# Altium schematic sheet UWB_5V-3V3_LDO.SchDoc
size A2; Organization: Altium Limited; Address1: L3, 12a Rodborough Rd; Address2: Frenchs Forest; Address3: NSW; Address4: Australia 2086
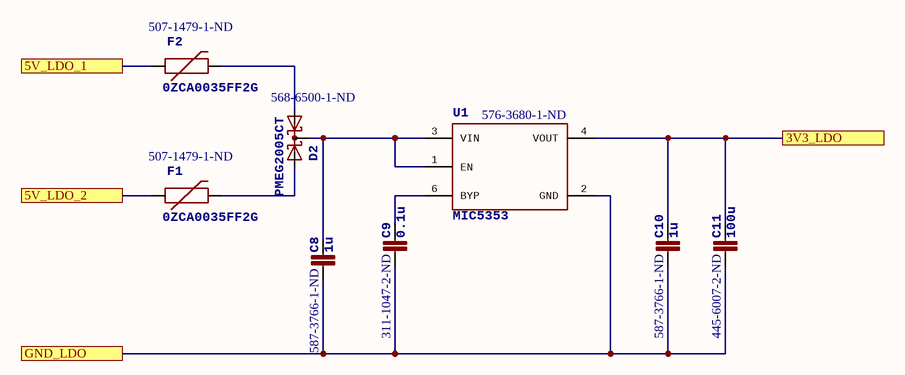
[diagram p0: UWB_5V-3V3_LDO.SchDoc]

## Parts
C8  1u  Supplier Part Number 1: 587-3766-1-ND  [0603-CAP]
C9  0.1u  Supplier Part Number 1: 311-1047-2-ND  [0402-CAP]
C10  1u  Supplier Part Number 1: 587-3766-1-ND  [0603-CAP]
C11  100u  Supplier Part Number 1: 445-6007-2-ND  [1206-CAP]
D2  PMEG2005CT  Supplier Part Number 1: 568-6500-1-ND  [SOT23-3]
F1  0ZCA0035FF2G  Supplier Part Number 1: 507-1479-1-ND  [PTC-1206]
F2  0ZCA0035FF2G  Supplier Part Number 1: 507-1479-1-ND  [PTC-1206]
U1  MIC5353  Supplier Part Number 1: 576-3680-1-ND  [MLF-6-1.6MM]

## Ports
3V3_LDO, 5V_LDO_1, 5V_LDO_2, GND_LDO

## Nets
3V3_LDO: C10.1 C11.1 U1.4(VOUT) ; port 3V3_LDO
5V_LDO_1: F2.1 ; port 5V_LDO_1
5V_LDO_2: F1.1 ; port 5V_LDO_2
GND_LDO: C8.2 C9.2 C10.2 C11.2 U1.2(GND) ; port GND_LDO
NetC8_1: C8.1 D2.3(CC) U1.1(EN) U1.3(VIN)
NetC9_1: C9.1 U1.6(BYP)
NetD2_1: D2.1(A1) F2.2
NetD2_2: D2.2(A2) F1.2

## Notes on the sheet
- https://github.com/OpenMotorDrive
- Title
- ProfiCNC Pty. Ltd.
- https://creativecommons.org/licenses/by-nc-sa/4.0/
- For Commercial use, please contact ProfiCNC
- ProfiCNC does NOT guaranty these drawings as fit for any purpose, you must verify this information before attempting to use it in any way.  USE AT OWN RISK
- Size:
- Date:
- File:
- A2
- Number:
- Time:
- Revision:
- Sheet
- of

## Library data of the parts
C8 C10 = CAPACITOR-0603: PARTNO: LMK107B7105KA-T; DOC_NUM: 1; YEAR: 2014; REV: X2; Supplier 1: Digi-Key
C9 = CAPACITOR-0402: PARTNO: LMK105BJ104KV-F; DOC_NUM: 1; YEAR: 2014; REV: X2; Supplier 1: Digi-Key
C11 = CAPACITOR-1206: PARTNO: C3216X5R1A107M160AC; DOC_NUM: 1; YEAR: 2014; REV: X2; Supplier 1: Digi-Key
D2 = PMEG2005CT: DIODE SCHOTTKY 20V 500MA TO236AB; Supplier 1: Digi-Key; Value: 20V
F1 F2 = PTCSMD: PTC RESTTBLE 0.35A 16V CHIP 1206; Supplier 1: Digi-Key; Value: 0.35A
U1 = MIC5353: MIC5353 - 500mA LDO in 1.6mm × 1.6mm Package   The MIC5353 is a high-performance, single-output, ultra- low LDO (ULDOTM) regulator, offering a low total output noise of 30μVRMS. The MIC5353 is capable of sourcing 500mA output current and offers high-PSRR and low- output noise, making it an ideal solution for RF applications.   The MIC5353 provides 2% accuracy, extremely low dropout voltage (160mV @ 500mA), and low ground current (typically 90μA) making it ideal for battery-operated applications. When disabled, the MIC5353 enters a zero- off-mode current state, thereby drawing almost no current.   The MIC5353 is available in the 1.6mm x 1.6mm Thin MLF® package, occupying only 2.56mm2 of PCB area, a 36% reduction in board area compared to SC-70 and 2mm x 2mm Thin MLF® packages.; Supplier 1: Digi-Key